# EAGLE schematic TeamFlag (EAGLE 7.6.0)
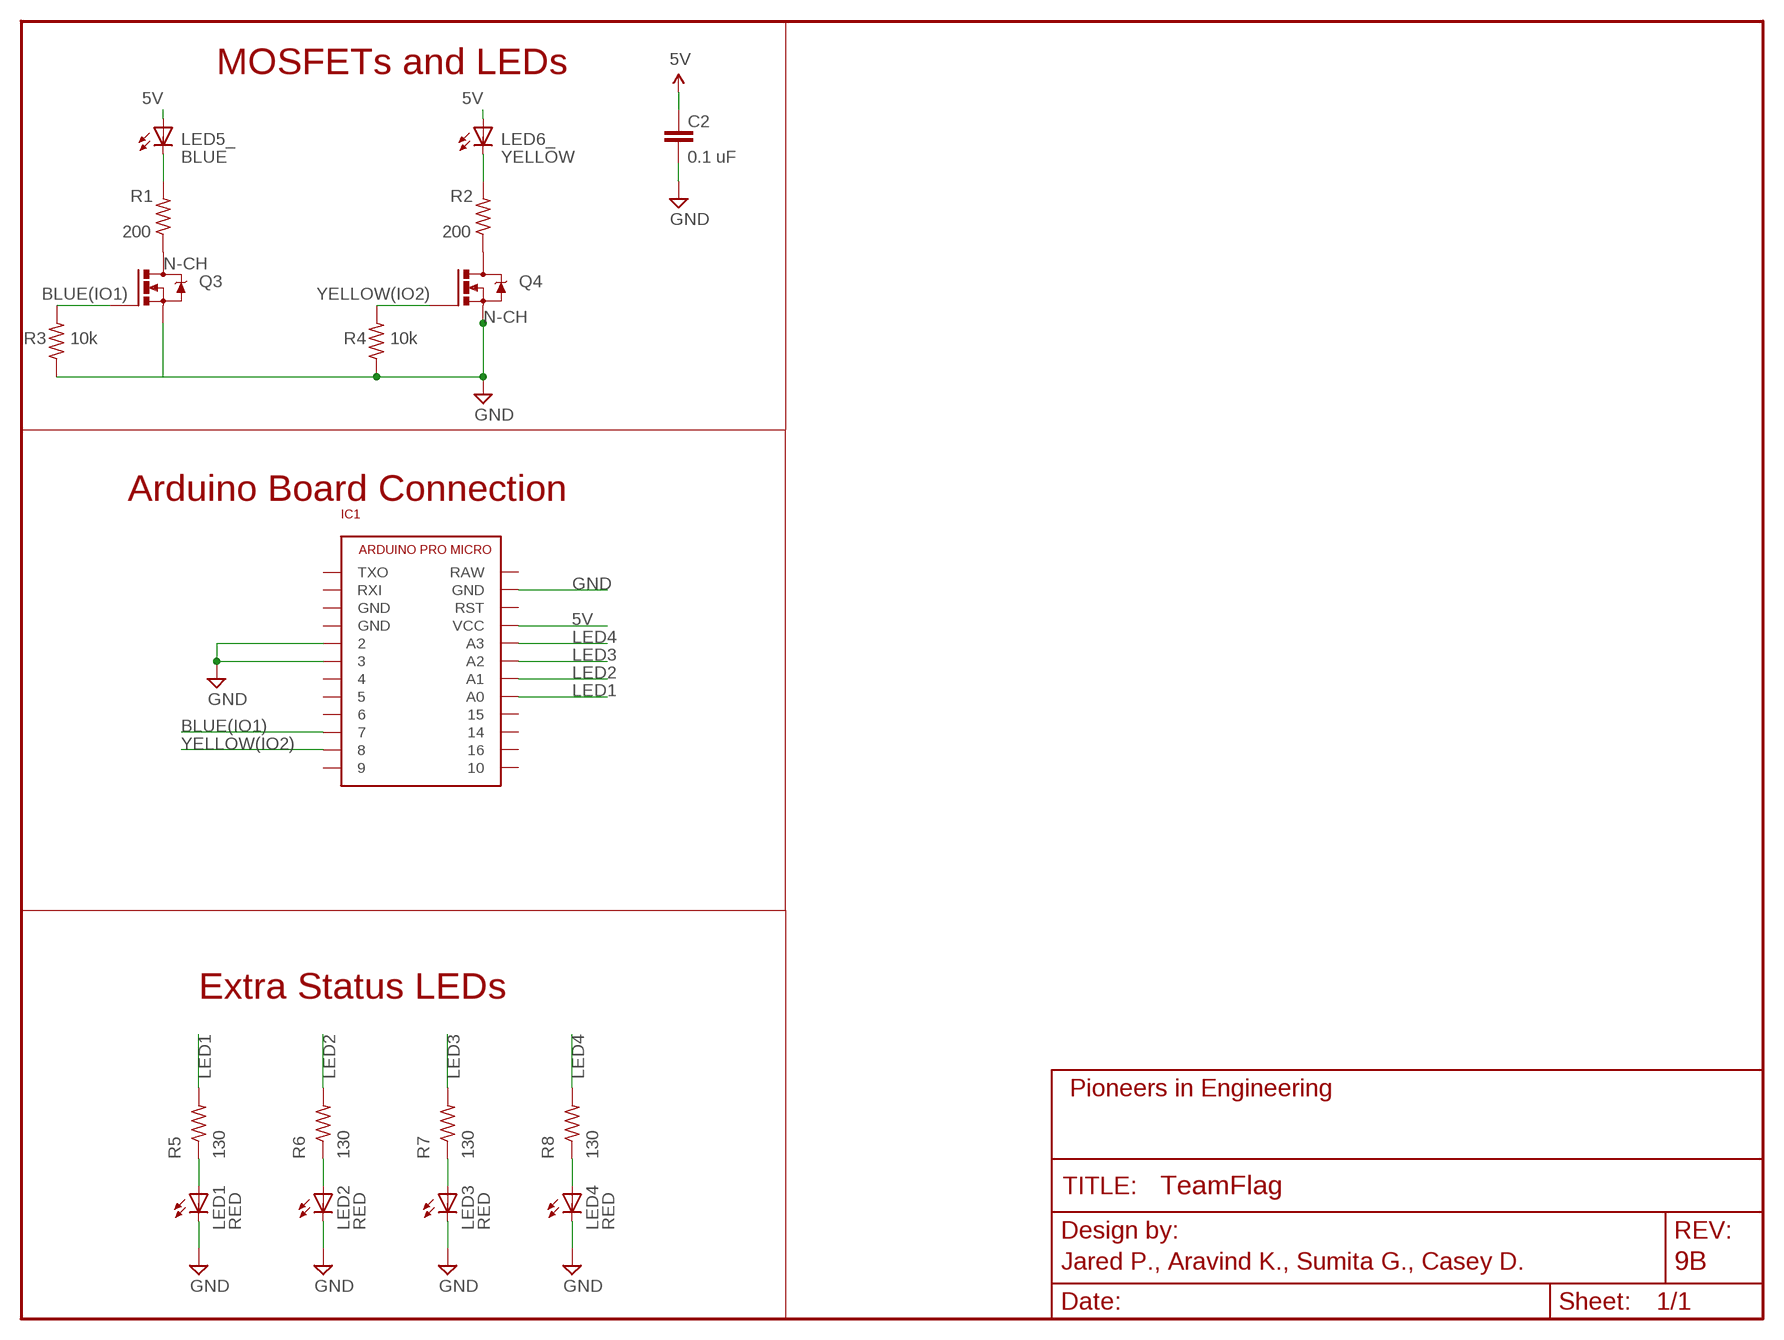
[diagram p0: schematic, sheet 1]
FRAME1 (FRAME_SCHEMATIC): AUTHOR: Jared P., Aravind K., Sumita G., Casey D.; REVISION: 9B

## Parts
C2  0.1 uF  CAP0603-CAP  [0603-CAP]
IC1  ARDUINO_PRO_MICROSMD  [ARDUINO_PRO_MICRO_SM]
LED1  RED  LED0805  [LED-0805]
LED2  RED  LED0805  [LED-0805]
LED3  RED  LED0805  [LED-0805]
LED4  RED  LED0805  [LED-0805]
LED5_  BLUE  LEDLED5MM-NOFLAT  [LED5MM-NOFLAT]
LED6_  YELLOW  LEDLED5MM-NOFLAT  [LED5MM-NOFLAT]
Q3  N-CH  N-CHANNEL-MOSFETSOT23-3  [SOT23-3]
Q4  N-CH  N-CHANNEL-MOSFETSOT23-3  [SOT23-3]
R1  200  R-US_R0603  [R0603]
R2  200  R-US_R0603  [R0603]
R3  10k  R-US_R0603  [R0603]
R4  10k  R-US_R0603  [R0603]
R5  130  R-US_R0603  [R0603]
R6  130  R-US_R0603  [R0603]
R7  130  R-US_R0603  [R0603]
R8  130  R-US_R0603  [R0603]

## Nets
5V: C2.1 IC1.VCC LED5_.A LED6_.A
BLUE(IO1): IC1.7 Q3.1(G) R3.2
BSOURCE: Q3.3(D) R1.1
GND: C2.2 IC1.2 IC1.3 IC1.GND@3(GND) LED1.C LED2.C LED3.C LED4.C Q3.2(S) Q4.2(S) R3.1 R4.1
LED1: IC1.A0 R5.2
LED1R: LED1.A R5.1
LED2: IC1.A1 R6.2
LED2R: LED2.A R6.1
LED3: IC1.A2 R7.2
LED3R: LED3.A R7.1
LED4: IC1.A3 R8.2
LED4R: LED4.A R8.1
N$2: LED5_.K(C) R1.2
N$3: LED6_.K(C) R2.2
YELLOW(IO2): IC1.8 Q4.1(G) R4.2
YSOURCE: Q4.3(D) R2.1
Unconnected: IC1.4 IC1.5 IC1.6 IC1.9 IC1.10 IC1.14 IC1.15 IC1.16 IC1.GND@1(GND) IC1.GND@2(GND) IC1.RAW IC1.RST IC1.RX(RXI) IC1.TX(TXO)

## Notes on the sheet
- MOSFETs and LEDs
- Arduino Board Connection
- Extra Status LEDs

## Library data of the parts
C2 = pie:CAP: Capacitor Standard 0603 ceramic capacitor, and 0.1" leaded capacitor.; PIE-INT-REF-NUM: CAPACITOR-GENERIC
IC1 = pie:ARDUINO_PRO_MICRO: Arduino Pro Micro Electrical System Year 9's Smart Sensor Core Pin Outs <https://cdn.sparkfun.com/assets/9/c/3/c/4/523a1765757b7f5c6e8b4567.png> Buy Here <http://www.aliexpress.com/item/Mini-Leonardo-Pro-Micro-ATmega32U4-5V-16MHz-Module-For-Arduino-Best-Quality/32284746884.html?ws_ab_test=searchweb201556_8,searchweb201602_2_10057_10056_10065_10055_10054_10067_10069_10059_10058_10017_10070_10060_10061_10052_10062_10053_10050_10051,searchweb201603_1&btsid=45993952-29ca-4de4-a0fb-c7fb72b8e1a5> Thru Hole Female Pins <http://www.digikey.com/product-search/en?keywords=929974E-01-12-ND> Surface Mount Female Pins <http://www.digikey.com/product-detail/en/sullins-connector-solutions/NPTC121KFXC-RC/S5604-ND/776062>
LED1-LED4 LED5_ LED6_ = pie:LED: LEDs Standard schematic elements and footprints for 5mm, 3mm, 1206, and 0603 sized LEDs. 5mm - Spark Fun Electronics SKU : COM-00529 (and others); PIE-INT-REF-NUM: LED
Q3 Q4 = pie:N-CHANNEL-MOSFET: N-channel TrenchMOS (TM) logic level FET Source: SOT23-3: http://www.nxp.com/documents/data_sheet/BSS123.pdf SOT669: http://www.nxp.com/documents/data_sheet/PH7030L.pdf
R1-R8 = pie:R-US_: RESISTOR, American symbol; DESCRIPTION: RESISTOR, American symbol; DISTRIBUTOR: DigiKey; MANUFACTURER: Rohm Semiconductor; NOTES: Cut Tape; PACKAGE: R0603; VALUE: >VALUE